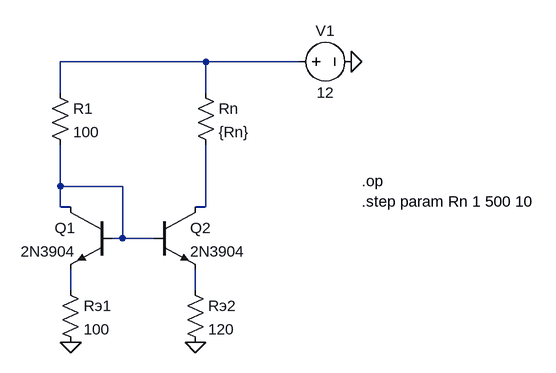
[diagram p0: schematic task1.asc]
task1.asc, the LTspice schematic file:
Version 4.1
SHEET 1 896 680
WIRE 368 64 144 64
WIRE 512 64 368 64
WIRE 144 112 144 64
WIRE 368 112 368 64
WIRE 144 256 144 192
WIRE 240 256 144 256
WIRE 144 288 144 256
WIRE 160 288 144 288
WIRE 368 288 368 192
WIRE 368 288 352 288
WIRE 240 336 240 256
WIRE 240 336 224 336
WIRE 288 336 240 336
WIRE 160 416 160 384
WIRE 352 416 352 384
FLAG 160 496 0
FLAG 352 496 0
FLAG 592 64 0
SYMBOL res 128 96 R0
SYMATTR InstName R1
SYMATTR Value 100
SYMBOL res 352 96 R0
SYMATTR InstName Rn
SYMATTR Value {Rn}
SYMBOL npn 224 288 M0
SYMATTR InstName Q1
SYMATTR Value 2N3904
SYMBOL npn 288 288 R0
SYMATTR InstName Q2
SYMATTR Value 2N3904
SYMBOL res 144 400 R0
SYMATTR InstName Rэ1
SYMATTR Value 100
SYMBOL res 336 400 R0
SYMATTR InstName Rэ2
SYMATTR Value 120
SYMBOL voltage 496 64 R270
WINDOW 0 32 56 VTop 2
WINDOW 3 -32 56 VBottom 2
SYMATTR InstName V1
SYMATTR Value 12
TEXT 608 248 Left 2 !.op\n.step param Rn 1 500 10

The netlist it stands for:
* task1.asc
R1 N001 N002 100
Rn N001 N003 {Rn}
Q1 N002 N002 N004 0 2N3904
Q2 N003 N002 N005 0 2N3904
Rэ1 N004 0 100
Rэ2 N005 0 120
V1 N001 0 12
.model NPN NPN
.model PNP PNP
.lib standard.bjt
.op
.step param Rn 1 500 10
.backanno
.end